# Altium schematic sheet 19VBuck_Polygon_Pour.SchDoc
size B; SheetNumber: 1; SheetTotal: 1
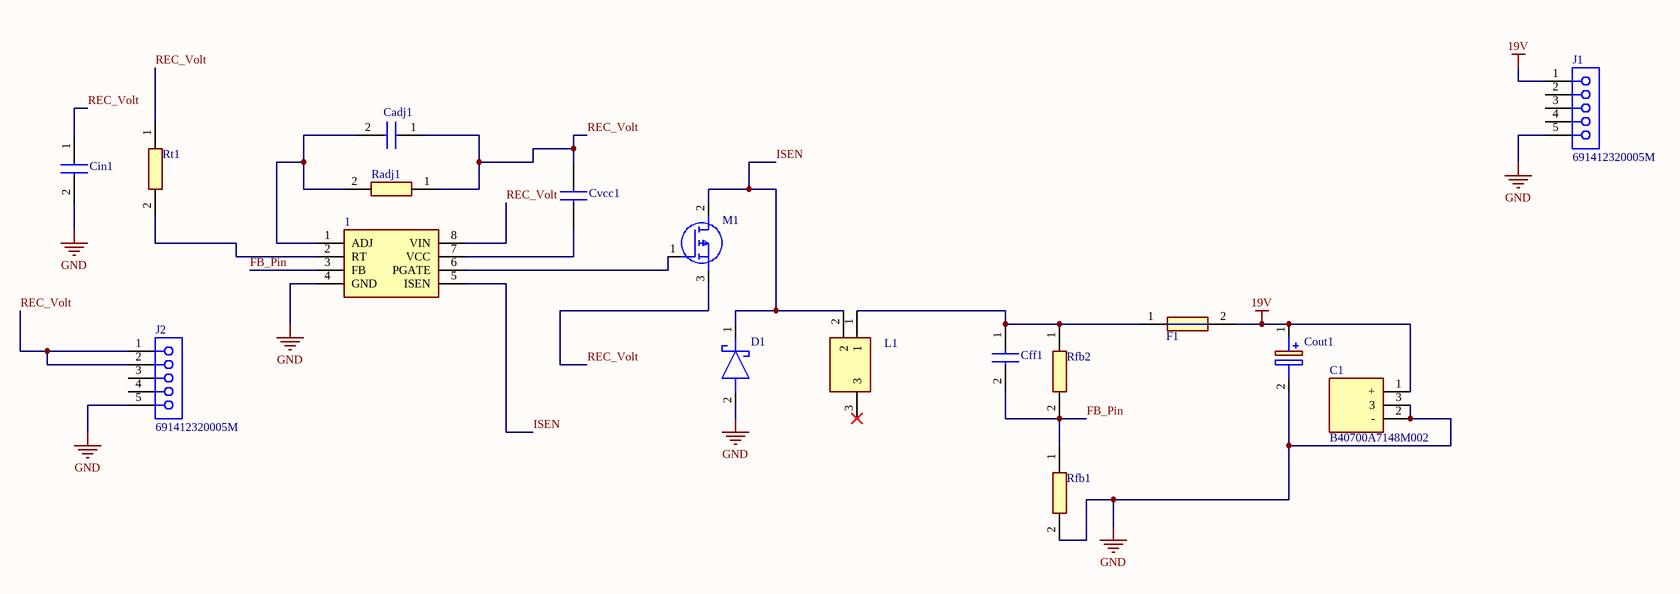
[diagram p0: 19VBuck_Polygon_Pour.SchDoc]

## Parts
1  LM25085AMM_NOPB  [SOP65P490X110-8N]  (value not drawn)
C1  B40700A7148M002  [B40700A7148M002]
Cadj1  C1206C102K5GACTU  [C1206]  (value not drawn)
Cff1  (no value)  [C1206]
Cin1  MSASU32MSB5106KPNA01  [CAPC3225X270N]  (value not drawn)
Cout1  293D106X9063E2TE3  [CAPPM7343X430N]  (value not drawn)
Cvcc1  TMK212BJ474KD-T  [CAPC2012X95N]  (value not drawn)
D1  SS24FL  [SODFL3617X108N]  (value not drawn)
F1  0407006.WR  [FUSC3216X98N]  (value not drawn)
J1  691412320005M  [691412320005M]
J2  691412320005M  [691412320005M]
L1  SER2915L-153KL  [SER2918H333KL]  (value not drawn)
M1  SUD50P04-08-GE3  [SIHD3N50DT4GE3]  (value not drawn)
Radj1  CRCW12062K21FKEA  [RESC3216X60N]  (value not drawn)
Rfb1  CRCW1206499RFKEA  [RESC3216X60N]  (value not drawn)
Rfb2  RC1206FR-0710KL  [RESC3116X65N]  (value not drawn)
Rt1  CRCW1206665KFKEA  [RESC3216X60N]  (value not drawn)

## Nets
19V: C1.1(+) Cout1.1(+) F1.2 J1.1
GND: 1.4(GND) C1.2(-) C1.3 Cin1.2 Cout1.2(-) D1.2(A) J1.5 J2.5 Rfb1.2
FB_Pin: 1.3(FB) Cff1.2 Rfb1.1 Rfb2.2
ISEN: 1.5(ISEN) D1.1(K) L1.2 M1.2(D)
REC_Volt: 1.8(VIN) Cadj1.1 Cin1.1 Cvcc1.2 J2.1 J2.2 M1.3(S) Radj1.1 Rt1.1
Net1_1: 1.1(ADJ) Cadj1.2 Radj1.2
Net1_2: 1.2(RT) Rt1.2
Net1_6: 1.6(PGATE) M1.1(G)
Net1_7: 1.7(VCC) Cvcc1.1
NetCff1_1: Cff1.1 F1.1 L1.1 Rfb2.1

Not connected (* = marked no-connect by the designer): J1 2 3 4; J2 3 4; L1 3*

## Library data of the parts
1 = LM25085AMM_NOPB: Integrated Circuit; Manufacturer_Name: Texas Instruments; Manufacturer_Part_Number: LM25085AMM/NOPB; Datasheet Link: http://www.ti.com/lit/gpn/LM25085A; Height: 1.1mm; Mouser Part Number: 926-LM25085AMM/NOPB; Mouser Price/Stock: https://www.mouser.co.uk/ProductDetail/Texas-Instruments/LM25085AMM-NOPB?qs=X1J7HmVL2ZFzLd0kBZ%2FkDw%3D%3D
C1 = B40700A7148M002: Capacitor Polarised; Manufacturer_Name: TDK; Datasheet Link: https://product.tdk.com/system/files/dam/doc/product/capacitor/aluminum-electrolytic/hybrid-polymer/data_sheet/20/30/db/aec/b40600_b40700.pdf; Height: 33mm; Manufacturer_Part_Number: B40700A7148M002
Cadj1 = C1206C102K5GACTU: Capacitor; Manufacturer_Name: YAGEO; Datasheet Link: https://content.kemet.com/datasheets/KEM_C1003_C0G_SMD.pdf; Manufacturer_Part_Number: C1206C102K5GACTU
Cff1 = C1206C333K5RACTU: Capacitor; Manufacturer_Name: YAGEO; Datasheet Link: https://content.kemet.com/datasheets/KEM_C1002_X7R_SMD.pdf; Manufacturer_Part_Number: C1206C333K5RACTU; Mouser Part Number: 80-C1206C333K5R; Mouser Price/Stock: https://www.mouser.com/Search/Refine.aspx?Keyword=80-C1206C333K5R
Cin1 = MSASU32MSB5106KPNA01: Capacitor; Manufacturer_Name: TAIYO YUDEN; Datasheet Link: https://4donline.ihs.com/images/VipMasterIC/IC/TAIY/TAIY-S-A0018972909/TAIY-S-A0018972909-1.pdf?hkey=61A2E4C270F0397D049F8F05BD4F1054; Height: 2.7mm; Manufacturer_Part_Number: MSASU32MSB5106KPNA01
Cout1 = 293D106X9063E2TE3: Capacitor Polarised; Manufacturer_Name: Vishay; Datasheet Link: http://www.vishay.com/docs/40002/293d.pdf; Height: 4.3mm; Manufacturer_Part_Number: 293D106X9063E2TE3; Mouser Part Number: 74-293D106X9063E2TE3; Mouser Price/Stock: https://www.mouser.co.uk/ProductDetail/Vishay-Sprague/293D106X9063E2TE3?qs=CPcc0c%2Fon9Gw9HhZerL1xQ%3D%3D; Arrow Part Number: 293D106X9063E2TE3; Arrow Price/Stock: https://www.arrow.com/en/products/293d106x9063e2te3/vishay
Cvcc1 = TMK212BJ474KD-T: TAIYO YUDEN - TMK212BJ474KD-T - CERAMIC CAPACITOR 0.47UF, 25V, X5R, 10%, 0805; Geometry.Height: 0.95mm; Mouser Part Number: 963-TMK212BJ474KD-T; Mouser Price/Stock: https://www.mouser.co.uk/ProductDetail/TAIYO-YUDEN/TMK212BJ474KD-T?qs=PzICbMaShUcnyRLJVHq5%252BA%3D%3D; Manufacturer_Name: TAIYO YUDEN; Manufacturer_Part_Number: TMK212BJ474KD-T; Datasheet Link: https://componentsearchengine.com/Datasheets/2/TMK212BJ474KD-T.pdf
D1 = SS24FL: Schottky Diode; Manufacturer_Name: onsemi; Datasheet Link: https://www.onsemi.com/pub/Collateral/SS26FL-D.PDF; Height: 1.08mm; Manufacturer_Part_Number: SS24FL; Mouser Part Number: 512-SS24FL; Mouser Price/Stock: https://www.mouser.co.uk/ProductDetail/onsemi-Fairchild/SS24FL?qs=tqW9UTzndZyvT5hdH%252BfSxg%3D%3D; Arrow Part Number: SS24FL; Arrow Price/Stock: https://www.arrow.com/en/products/ss24fl/on-semiconductor?utm_currency=USD&region=europe
F1 = 0407006.WR: Fuse; Manufacturer_Name: LITTELFUSE; Datasheet Link: https://m.littelfuse.com/~/media/electronics/datasheets/littelfuse_fuse_407_datasheet.pdf.pdf; Height: 0.985mm; Manufacturer_Part_Number: 0407006.WR; Mouser Part Number: 576-0407006.WR; Mouser Price/Stock: https://www.mouser.co.uk/ProductDetail/Littelfuse/0407006.WR?qs=sPbYRqrBIVmH0oD7q%252BOKfw%3D%3D; Arrow Part Number: 0407006.WR; Arrow Price/Stock: https://www.arrow.com/en/products/0407006.wr/littelfuse?utm_currency=USD&region=nac
J1 J2 = CMP-03913-78871500-2: Terminal Block, 3.81MM Pitch, 45 Deg, Screwless, 16 -30 AWG, 5 Pins; Packaging: Box; Lead Pitch: 3.81mm; Number of Pins: 5
L1 = SER2915L-153KL: Inductor; Manufacturer_Name: COILCRAFT; Datasheet Link: https://www.coilcraft.com/pdfs/ser2900.pdf; Height: 17mm; Manufacturer_Part_Number: SER2915L-153KL; Mouser Part Number: 994-SER2915L-153KL; Mouser Price/Stock: https://www.mouser.co.uk/ProductDetail/Coilcraft/SER2915L-153KL?qs=zCSbvcPd3pYvEeXdEWrnlg%3D%3D
M1 = SUD50P04-08-GE3: MOSFET (P-Channel); Manufacturer_Name: Vishay; Datasheet Link: https://www.vishay.com/docs/65594/sud50p04-08.pdf; Height: 2.38mm; Manufacturer_Part_Number: SUD50P04-08-GE3; Mouser Part Number: 781-SUD50P04-08-GE3; Mouser Price/Stock: https://www.mouser.co.uk/ProductDetail/Vishay-Semiconductors/SUD50P04-08-GE3?qs=WX95TUc1y56BTDQkv3VCeQ%3D%3D; Arrow Part Number: SUD50P04-08-GE3; Arrow Price/Stock: https://www.arrow.com/en/products/sud50p04-08-ge3/vishay?region=europe
Radj1 = CRCW12062K21FKEA: Resistor; Manufacturer_Name: Vishay; Datasheet Link: http://www.vishay.com/docs/20035/dcrcwe3.pdf; Height: 0.6mm; Manufacturer_Part_Number: CRCW12062K21FKEA; Mouser Part Number: 71-CRCW1206-2.21K-E3; Mouser Price/Stock: https://www.mouser.co.uk/ProductDetail/Vishay-Dale/CRCW12062K21FKEA?qs=v%252BxIQaJyuQoaBZMU5qB9Lw%3D%3D; Arrow Part Number: CRCW12062K21FKEA; Arrow Price/Stock: https://www.arrow.com/en/products/crcw12062k21fkea/vishay
Rfb1 = CRCW1206499RFKEA: Resistor; Manufacturer_Name: Vishay; Datasheet Link: http://www.vishay.com/docs/20035/dcrcwe3.pdf; Height: 0.6mm; Manufacturer_Part_Number: CRCW1206499RFKEA; Mouser Part Number: 71-CRCW1206-499-E3; Mouser Price/Stock: https://www.mouser.com/Search/Refine.aspx?Keyword=71-CRCW1206-499-E3
Rfb2 = RC1206FR-0710KL: Resistor; Manufacturer_Name: YAGEO; Datasheet Link: https://www.yageo.com/upload/media/product/app/datasheet/rchip/pyu-rc_group_51_rohs_l.pdf; Height: 0.65mm; Manufacturer_Part_Number: RC1206FR-0710KL; Mouser Part Number: 603-RC1206FR-0710KL; Mouser Price/Stock: https://www.mouser.co.uk/ProductDetail/YAGEO/RC1206FR-0710KL?qs=%252BhB4WxZmbVEJV82xdVgRUw%3D%3D; Arrow Part Number: RC1206FR-0710KL; Arrow Price/Stock: https://www.arrow.com/en/products/rc1206fr-0710kl/yageo?utm_currency=USD&region=europe
Rt1 = CRCW1206665KFKEA: Resistor; Manufacturer_Name: Vishay; Height: 0.6mm; Manufacturer_Part_Number: CRCW1206665KFKEA